# Altium schematic sheet USB-PHY.SchDoc: TEBF0808 - USB
size A4; Organization: Trenz Electronic GmbH; DocumentNumber: TEBF0808; Revision: 04; SheetNumber: 13; SheetTotal: 36; Date: 2016-09-29; CompanyName: Trenz Electronic GmbH
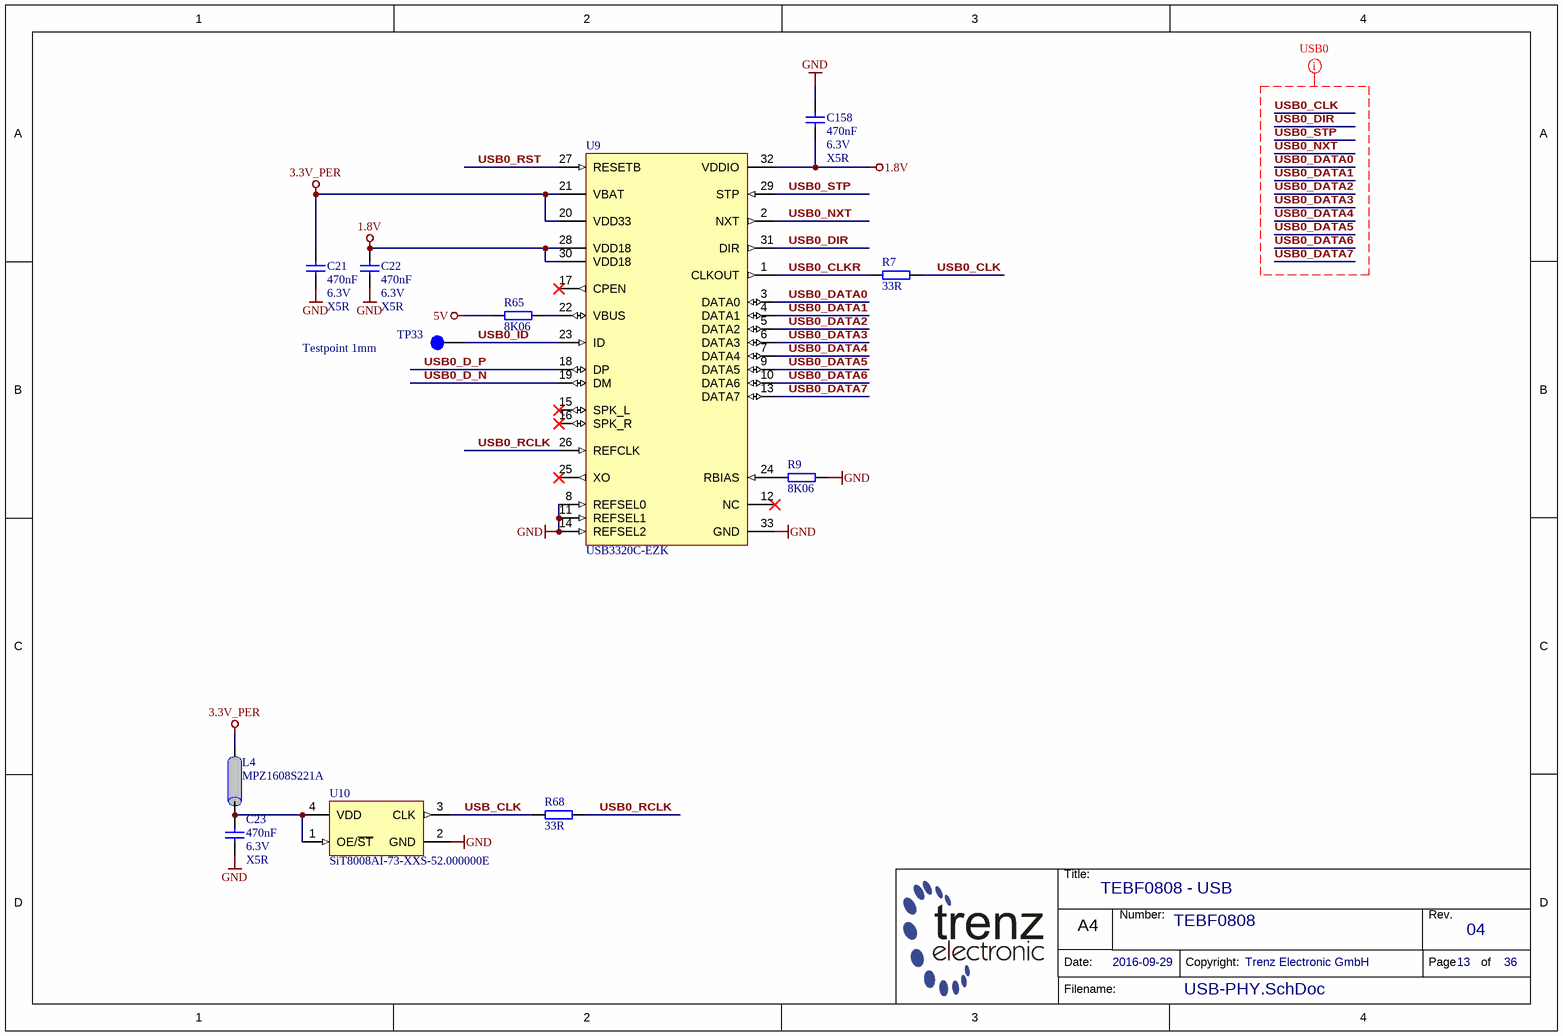
[diagram p0: USB-PHY.SchDoc]

## Parts
C21  470nF  Voltage: 6.3V  Technology: X5R  [CAPC1005X55N]
C22  470nF  Voltage: 6.3V  Technology: X5R  [CAPC1005X55N]
C23  470nF  Voltage: 6.3V  Technology: X5R  [CAPC1005X55N]
C158  470nF  Voltage: 6.3V  Technology: X5R  [CAPC1005X55N]
L4  MPZ1608S221A  [INDC1608X95N]
R7  33R  [RESC1005X40N]
R9  8K06  [RESC1005X40N]
R65  8K06  [RESC1005X40N]
R68  33R  [RESC1005X40N]
TP33  Testpoint 1mm  [TP_1mm]
U9  USB3320C-EZK  [QFN50P500X500X100-33N-345]
U10  SiT8008AI-73-XXS-52.000000E  [2016]

## Nets
1.8V: C22.1 C158.2 U9.28(VDD18) U9.30(VDD18) U9.32(VDDIO)
3.3V_PER: C21.1 L4.1 U9.20(VDD33) U9.21(VBAT)
5V: R65.1
GND: C21.2 C22.2 C23.2 C158.1 R9.2 U9.8(REFSEL0) U9.11(REFSEL1) U9.14(REFSEL2) U9.33(GND) U10.2(GND)
USB0_CLK: R7.2
USB0_CLKR: R7.1 U9.1(CLKOUT)
USB0_D_N: U9.19(DM)
USB0_D_P: U9.18(DP)
USB0_DATA0: U9.3(DATA0)
USB0_DATA1: U9.4(DATA1)
USB0_DATA2: U9.5(DATA2)
USB0_DATA3: U9.6(DATA3)
USB0_DATA4: U9.7(DATA4)
USB0_DATA5: U9.9(DATA5)
USB0_DATA6: U9.10(DATA6)
USB0_DATA7: U9.13(DATA7)
USB0_DIR: U9.31(DIR)
USB0_ID: TP33.1 U9.23(ID)
USB0_NXT: U9.2(NXT)
USB0_RCLK: R68.2 U9.26(REFCLK)
USB0_RST: U9.27(RESETB)
USB0_STP: U9.29(STP)
USB_CLK: R68.1 U10.3(CLK)
NetC23_1: C23.1 L4.2 U10.1(OE/~{ST}) U10.4(VDD)
NetR9_1: R9.1 U9.24(RBIAS)
NetR65_2: R65.2 U9.22(VBUS)

Not connected (* = marked no-connect by the designer): U9 12(NC)* 15(SPK_L)* 16(SPK_R)* 17(CPEN)* 25(XO)*

## Layout directives
net class USB0: USB0_CLK, USB0_DATA0, USB0_DATA1, USB0_DATA2, USB0_DATA3, USB0_DATA4, USB0_DATA5, USB0_DATA6, USB0_DATA7, USB0_DIR, USB0_NXT, USB0_STP

## Notes on the sheet
- Title:
- Number:
- Rev.
- Date:
- A4
- Copyright:
- Page
- of
- Filename:

## Library data of the parts
C21-C23 C158 = 23659: KON 470nF 6,3V X5R SMD; AN: 23659; Value: 470n; Mixed: SMT; Preferred: Yes; Case: 1005 (0402)
L4 = 22718: Ferritdurchführung MPZ1608S221A; AN: 22718; Mixed: SMT; Trenz-Stock: Yes; Value: 220 OHm @ 100MHz; Case: 1608 (0603); HelpURL: B:\AD\adlib\datasheet\MPZ1608; Preferred: Yes; H-ART: MPZ1608S221A
R7 R68 = 22770: WID SMD 33R 1% 0,063W; AN: 22770; Value: 33; Mixed: SMT; Preferred: Yes; Case: 1005 (0402); Tolerance: 1%; Technology: TK100
R9 R65 = 25052: WID SMD 8K06 1% 0,063W; AN: 25052; Value: 8.06K; Mixed: SMT; Preferred: Yes; Case: 1005 (0402); Tolerance: 1%; Technology: TK100
TP33 = 25063: AN: 25063; Mixed: SMT
U9 = 24992: AN: 24992; Trenz-Stock: Yes; Mixed: SMT; Case: QFN32; HelpURL: B:\AD\adlib\datasheet\USB3320; H-ART: USB3320C-EZK
U10 = 25009: SiT8008AI-73-XXS-52.000000E MEMS Oszillator 52MHz; AN: 25009; Value: 52M; Trenz-Stock: Yes; Mixed: SMT; Case: 2.0  x 1.6mm; HelpURL: B:\AD\adlib\datasheet\SiT8008; Preferred: Yes; H-ART: SiT8008AI-73-XXS-52.000000E